# EasyEDA Pro project codeday-badge.eprj, board CodeDay Badge
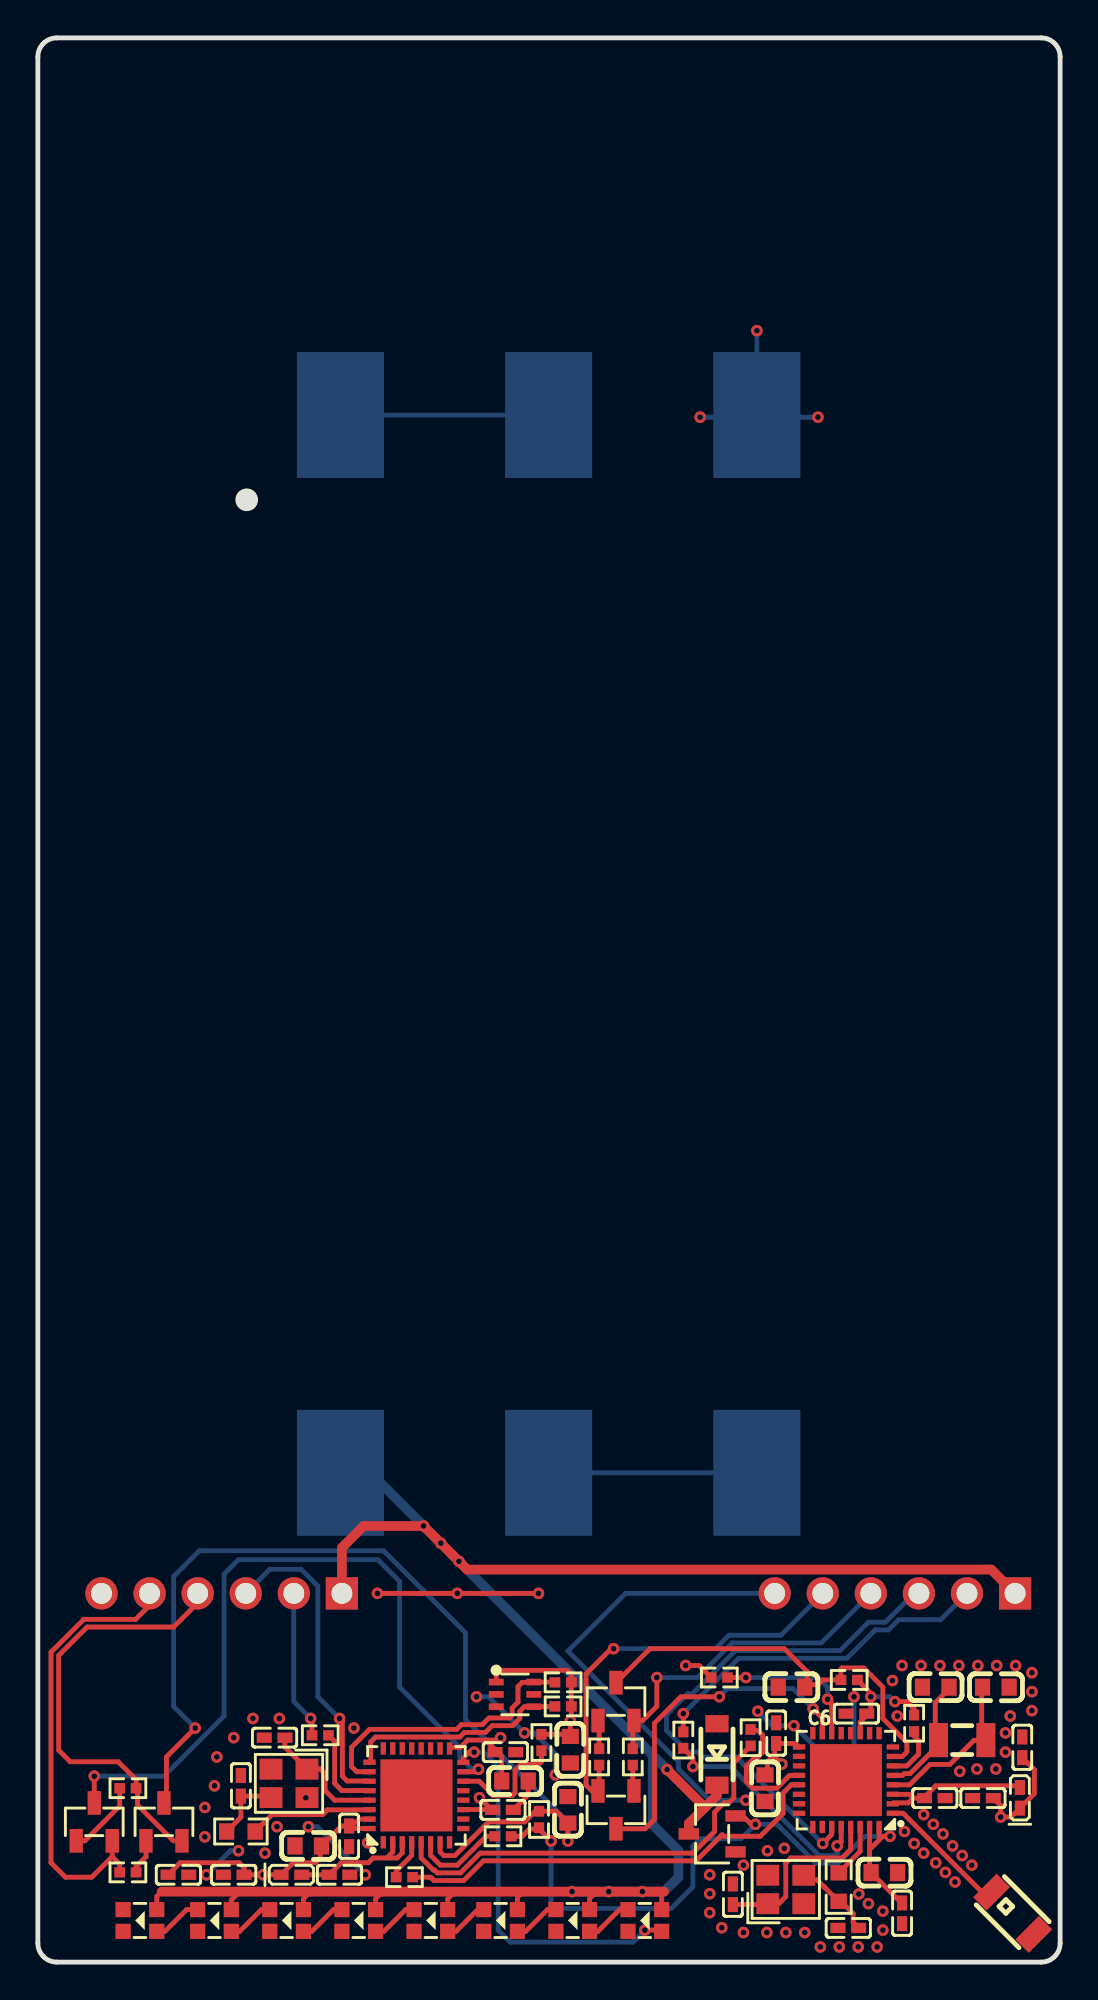
[diagram p4: board, top side]
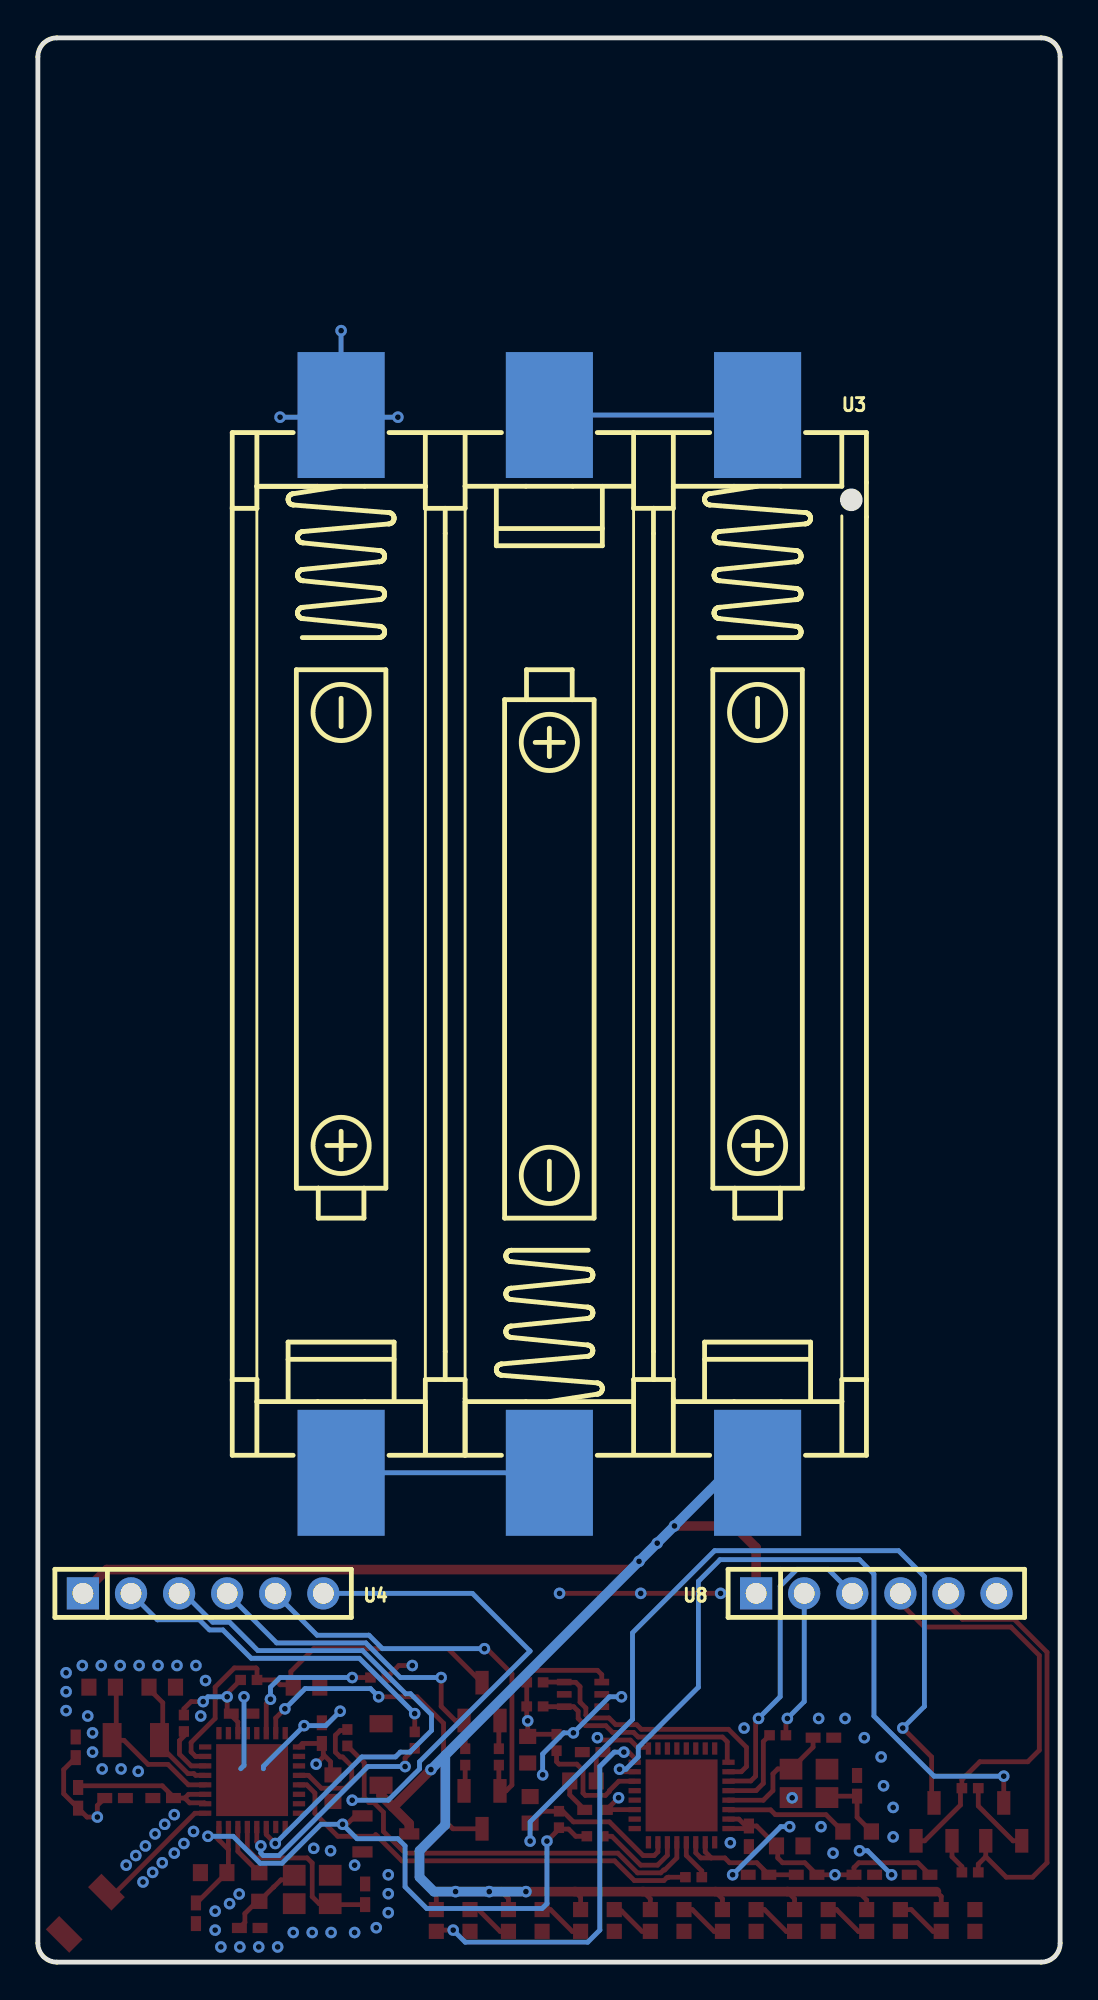
[diagram p5: board, bottom side, seen from below]

Outline 54 x 101.6 mm; copper layers: Top Layer, Bottom Layer. Coordinates in mm from the lower left corner of the outline.
Outline path: 0,100.6 0,1 arc(0.29,0.29) 1,0 53,0 arc(53.71,0.29) 54,1 54,100.6 arc(53.71,101.31) 53,101.6 1,101.6 arc(0.29,101.31) 0,100.6
Stack: Top Layer 0.035mm / Dielectric1 1.51mm FR4 er 4.5 / Bottom Layer 0.035mm

## Design rules (mm)
spacing safeClearance (default): track to track 0.152, other pairs 0.152 to 0.3
track width trackWidth (default): min 0.127, default 0.254, max 2.54
differential pair differentialPair (default): width min 0.127, default 0.254, max 2.54; gap min 0.152, default 0.152
via viaSize (default): diameter min 0.5, default 0.61, max 10; hole min 0.3, default 0.305, max 6

## Placement (name value [footprint] x y rotation side)
C1  10nF  [C0402]  45.65 2.58 90 top
C2  100nF  [C0402_NEW]  49.92 8.66 0 top
C3  1uF  [C0603]  44.72 4.72 180 top
C4  100nF  [C0402_NEW]  47.38 8.66 180 top
C5  10uF  [C0402]  52 11.34 270 top
C6  100nF  [C0402_NEW]  43.24 13.12 0 top
C7  100nF  [C0402_NEW]  39 12.09 270 top
C8  1uF  [C0603]  38.41 9.18 90 top
C9  10pF  [C0402]  36.71 3.58 90 top
C10  10pF  [C0402]  42.81 1.8 0 top
C11  15pF  [C0603]  50.6 14.52 180 top
C12  15pF  [C0603]  47.43 14.52 0 top
C13  1uF  [C0603]  39.81 14.52 0 top
C14  10nF  [C0402]  16.44 6.64 90 top
C15  100nF  [C0402_NEW]  7.42 4.61 180 top
C16  1uF  [C0603]  14.28 6.14 0 top
C17  100nF  [C0402_NEW]  15.93 4.61 180 top
C18  10uF  [C0402]  10.35 4.61 0 top
C19  100nF  [C0402_NEW]  24.57 8.04 180 top
C20  100nF  [C0402_NEW]  24.7 11.09 180 top
C21  1uF  [C0603]  25.2 9.56 180 top
C22  10pF  [C0402]  12.5 11.85 180 top
C23  10pF  [C0402]  10.73 9.31 270 top
C24  1uF  [C0603]  28 8.04 270 top
C25  1uF  [C0603]  28.13 11.22 90 top
D1  XL-0807RGBC-WS2812B  [LED-SMD_4P-L2.0-W1.8_CY-0807]  32.06 2.2 0 top
D2  XL-0807RGBC-WS2812B  [LED-SMD_4P-L2.0-W1.8_CY-0807]  28.25 2.2 0 top
D3  XL-0807RGBC-WS2812B  [LED-SMD_4P-L2.0-W1.8_CY-0807]  24.44 2.2 0 top
D4  XL-0807RGBC-WS2812B  [LED-SMD_4P-L2.0-W1.8_CY-0807]  20.76 2.2 0 top
D5  XL-0807RGBC-WS2812B  [LED-SMD_4P-L2.0-W1.8_CY-0807]  16.95 2.2 0 top
D6  XL-0807RGBC-WS2812B  [LED-SMD_4P-L2.0-W1.8_CY-0807]  13.14 2.2 0 top
D7  XL-0807RGBC-WS2812B  [LED-SMD_4P-L2.0-W1.8_CY-0807]  9.33 2.2 0 top
D8  XL-0807RGBC-WS2812B  [LED-SMD_4P-L2.0-W1.8_CY-0807]  5.39 2.2 0 top
D10  BZT52C5V1  [SOD-123_L2.7-W1.6-LS3.7-R-RD]  35.87 10.96 90 top
L1  2nH  [L0402-RD]  51.87 8.68 90 top
L2  2nH  [L0402-RD]  13.39 4.61 0 top
Q1  MMBT2222A 1P  [SOT-23-3_L2.9-W1.3-P1.90-LS2.4-BR]  30.54 8.04 90 top
Q2  MMBT2222A 1P  [SOT-23-3_L2.9-W1.3-P1.90-LS2.4-BR]  30.54 13.76 270 top
Q3  MMBT2222A 1P  [SOT-23-3_L2.9-W1.3-P1.90-LS2.4-BR]  2.98 7.41 270 top
Q4  MMBT2222A 1P  [SOT-23-3_L2.9-W1.3-P1.90-LS2.4-BR]  6.66 7.41 270 top
R1  10kΩ  [R0402]  46.29 12.61 270 top
R2  22Ω  [R0603]  42.3 3.96 270 top
R3  499Ω  [R0402]  34.09 11.72 90 top
R4  10kΩ  [R0402]  42.86 14.9 180 top
R5  12kΩ  [R0402]  31.43 10.83 270 top
R6  12kΩ  [R0402]  29.65 10.83 90 top
R7  10kΩ  [R0402]  36 15.03 0 top
R8  10kΩ  [R0402]  24.57 6.64 180 top
R9  22Ω  [R0603]  10.73 6.9 180 top
R10  499Ω  [R0402]  14.92 11.98 180 top
R11  10kΩ  [R0402]  26.6 11.6 270 top
R12  12kΩ  [R0402]  4.76 9.18 180 top
R13  12kΩ  [R0402]  4.76 4.74 0 top
R14  10kΩ  [R0402]  26.47 7.53 90 top
R15  499Ω  [R0402]  37.65 11.85 90 top
R16  499Ω  [R0402]  19.36 4.48 180 top
R17  2kΩ  [R0402]  27.74 14.77 0 top
R18  2kΩ  [R0402]  27.74 13.5 0 top
U1  ESP32-C3FH4  [QFN-32_L5.0-W5.0-P0.50-TL-EP3.7]  42.69 9.61 180 top
U2  XC6206P332MR  [SOT-23-3_L2.9-W1.6-P1.90-LS2.8-BR]  35.62 6.77 0 top
U3  BH-AAA-B5AA005  [BAT-SMD_BH-AAA-B5AA005]  26.98 53.76 270 bottom
U4  ad8fa1fdb8d44eac8dc13500dd650be4  [HDR-TH_6P-P2.54-V-M-A]  45.27 19.47 180 bottom
U5  ANT3216LL00R2400A  [ANT-SMD_L3.2-W1.6]  51.49 2.58 315 top
U6  ESP32-C3FH4  [QFN-32_L5.0-W5.0-P0.50-TL-EP3.7]  20 8.8 90 top
U7  LTR-303ALS-01  [SOT-363_L2.0-W1.3-P0.65-LS2.1-BL]  25.2 14.14 270 top
U8  ad8fa1fdb8d44eac8dc13500dd650be4  [HDR-TH_6P-P2.54-V-M-A]  9.71 19.47 180 bottom
X1  40MHz  [CRYSTAL-SMD_4P-L2.5-W2.0-BL]  39.51 3.84 0 top
X2  32.768kHz  [FC-135R_L3.2-W1.5]  48.83 11.72 0 top
X3  40MHz  [CRYSTAL-SMD_4P-L2.5-W2.0-BL]  13.27 9.44 180 top

## Footprints (pads in the part's own frame, mm; a bottom-side part is the same pattern mirrored in y, then rotated)
ANT-SMD_L3.2-W1.6
  rect 1x1.75 smd: 1(-1.578,0) 2(1.578,0)
BAT-SMD_BH-AAA-B5AA005
  rect 6.65x4.6 smd: 1(-27.925,11) 2(-27.925,0) 3(-27.925,-11) 4(27.925,-11) 5(27.925,0) 6(27.925,11)
C0402
  rect 0.79x0.54 smd: 1(-0.545,0) 2(0.545,0)
C0402_NEW
  rect 0.79x0.54 smd: 1(-0.545,0) 2(0.545,0)
C0603
  rect 0.8x0.9 smd: 1(-0.7,0) 2(0.7,0)
CRYSTAL-SMD_4P-L2.5-W2.0-BL
  rect 1.2x1.1 smd: 1(-0.95,-0.75) 2(0.95,-0.75) 3(0.95,0.75) 4(-0.95,0.75)
FC-135R_L3.2-W1.5
  rect 1x1.8 smd: 1(-1.25,0) 2(1.25,0)
HDR-TH_6P-P2.54-V-M-A
  rect 1.7x1.7 hole 1.1: 1(-6.35,0)
  round 1.7 hole 1.1: 2(-3.81,0) 3(-1.27,0) 4(1.27,0) 5(3.81,0) 6(6.35,0)
L0402-RD
  rect 0.79x0.54 smd: 1(-0.545,0) 2(0.545,0)
LED-SMD_4P-L2.0-W1.8_CY-0807
  rect 0.8x0.8 smd: 1(0.889,0.575) 2(-0.889,0.575) 3(-0.889,-0.575) 4(0.889,-0.575)
QFN-32_L5.0-W5.0-P0.50-TL-EP3.7
  rect 0.65x0.28 smd: 1(-2.478,1.75) 2(-2.478,1.25) 3(-2.478,0.75) 4(-2.478,0.25) 5(-2.478,-0.25) 6(-2.478,-0.75) 7(-2.478,-1.25) 8(-2.478,-1.75) 17(2.478,-1.75) 18(2.478,-1.25) 19(2.478,-0.75) 20(2.478,-0.25) 21(2.478,0.25) 22(2.478,0.75) 23(2.478,1.25) 24(2.478,1.75)
  rect 0.28x0.65 smd: 9(-1.75,-2.478) 10(-1.25,-2.478) 11(-0.75,-2.478) 12(-0.25,-2.478) 13(0.25,-2.478) 14(0.75,-2.478) 15(1.25,-2.478) 16(1.75,-2.478) 25(1.75,2.478) 26(1.25,2.478) 27(0.75,2.478) 28(0.25,2.478) 29(-0.25,2.478) 30(-0.75,2.478) 31(-1.25,2.478) 32(-1.75,2.478)
  rect 3.8x3.8 smd: 33(0,0)
R0402
  rect 0.566x0.54 smd: 1(-0.433,0) 2(0.433,0)
R0603
  rect 0.806x0.864 smd: 1(-0.753,0) 2(0.753,0)
SOD-123_L2.7-W1.6-LS3.7-R-RD
  rect 0.909x1.219 smd: 1(1.625,0) 2(-1.625,0)
SOT-23-3_L2.9-W1.3-P1.90-LS2.4-BR
  rect 1.25x0.7 smd: 1(1,-0.95) 2(1,0.95) 3(-1,0)
SOT-23-3_L2.9-W1.6-P1.90-LS2.8-BR
  rect 1.07x0.6 smd: 1(1.235,-0.95) 2(1.235,0.95) 3(-1.235,0)
SOT-363_L2.0-W1.3-P0.65-LS2.1-BL
  rect 0.35x0.78 smd: 1(-0.65,-0.99) 2(0,-0.99) 3(0.65,-0.99) 4(0.65,0.99) 5(0,0.99) 6(-0.65,0.99)

## Nets
As in the schematic.

Pads without a net: D8 2; U1 8 9 10 12 13 18 19 22 23 24 25 26; U5 2; U6 1 8 9 10 12 13 18 19 20 21 22 23 24; U7 2 5

## Via types
v1: diameter 0.61, hole 0.305, Top Layer to Bottom Layer, 115 vias

## Routing (per net, layer and track width the routed paths; a pad name or vN(x,y) marks a point on that pad's centre or on a via; arc(x,y) is an arc through that point)
+5V: length 117.4
  Top Layer w0.254: D7.1 10.22,3.28 10.66,3.72 ; D3.1 25.33,3.42 25.63,3.72 ; D1.1 32.95,3.6 33.08,3.72 ; 6.54,3.72 6.28,3.47 6.28,2.77 ; D4.1 21.65,3.34 22.03,3.72 ; 14.41,3.72 14.03,3.34 D6.1 ; 18.22,3.72 17.84,3.34 D5.1 ; 29.51,3.72 29.14,3.35 D2.1
  Top Layer w0.508: v1(33.24,10.17) 35.21,8.19 35.26,8.19 ; D10.2 35.87,8.8 35.26,8.19 ; U2.3 34.38,7.31 35.26,8.19 ; U8.1 16.06,21.88 17.2,23.03 20.37,23.03 v1(20.37,23.03) v1(21.28,22.12) v1(22.24,21.16) 22.68,20.73 50.36,20.73 U4.1 ; 33.08,3.72 v1(31.94,3.72) v1(30.16,3.72) v1(28.22,3.72) 6.54,3.72
  Bottom Layer w0.254: 15.98,25.33 18.08,25.33
  Bottom Layer w0.508: 28.51,3.72 v1(30.16,3.72) v1(31.94,3.72) 33.08,3.72 33.84,4.48 33.84,5.88 32.48,7.25 32.48,10.93 ; 32.48,10.93 v1(33.24,10.17) ; 32.48,10.93 v1(22.24,21.16) v1(21.28,22.12) v1(20.37,23.03) 18.08,25.33
GND: length 60.6
  Top Layer w0.254: X3.4 14.17,8.69 v1(14.16,8.68) ; C19.1 25.9,8.83 C21.1
  Bottom Layer w0.254: v1(41.21,81.57) 38.38,81.57 37.98,81.18 ; v1(23.17,14.01) 23.81,14.01 v1(25.71,12.1) 26.22,12.1 27.33,10.99 v1(27.33,9.89) ; U4.6 31.05,19.47 28,16.42 33.84,10.58 33.84,10.2 35.49,8.55 v1(37.4,8.55) ; 42.09,10.21 42.09,10.34 v1(39.94,12.49) 38.79,12.49 v1(38.03,13.25) ; v1(17.3,4.61) 14.76,7.15 v1(14.29,7.15) ; 43.29,10.21 43.11,10.38 v1(43.11,14.01) ; v1(8.9,4.61) 10.17,5.88 v1(10.6,5.88) ; v1(34.98,81.57) 37.59,81.57 37.98,81.18 ; 37.98,81.18 v1(37.98,86.14)
  vias: v1(8.82,8.17) v1(8.82,6.61) v1(9.33,9.31) v1(9.46,10.83) v1(10.35,11.85) v1(11.36,12.87) v1(12,5.75) v1(12.63,7.15) v1(12.76,12.87) v1(16.7,12.36) v1(17.42,6.3) v1(35.49,4.61) v1(35.49,3.61) v1(35.49,2.61) v1(36.13,1.82) v1(37.27,5.12) v1(37.27,1.56) v1(38.51,1.56) v1(38.54,5.88) v1(39.43,6.01) v1(39.51,1.56) v1(40.51,1.56) v1(41.33,0.8) v1(42.33,0.8) v1(43.36,3.6) v1(43.33,0.8) v1(43.87,3.09) v1(44.33,0.8) v1(44.64,2.69) v1(44.64,1.69) v1(45.14,14.87) v1(45.4,12.99) v1(45.65,15.66) v1(45.78,6.9) v1(46.29,6.26) v1(46.65,15.66) v1(46.79,7.79) v1(46.79,5.75) v1(47.3,7.28) v1(47.43,5.25) v1(47.65,15.66) v1(47.81,6.77) v1(47.94,4.74) v1(48.32,6.14) v1(48.45,4.23) v1(48.65,15.66) v1(48.7,10.07) v1(48.83,5.63) v1(49.33,5.12) v1(49.6,10.2) v1(49.65,15.66) v1(50.6,10.2) v1(50.65,15.66) v1(51.11,12.1) v1(51.11,11.09) v1(51.37,12.99) v1(51.65,15.66) v1(52.51,15.28) v1(52.51,14.28) v1(52.51,13.28)
VCC: length 93.3
  Top Layer w0.254: C19.2 23.97,8.04 23.95,8.05 ; v1(45.27,13.76) 45.91,13.76 46.29,13.37 R1.1 ; R8.1 25.58,6.64 25.97,7.02 26.4,7.02 R14.1 26.47,7.02 v1(27.11,6.39) ; 44.44,6.44 44.63,6.64 v1(45.02,6.64) ; 44.44,6.44 43.94,5.94 ; 44.44,6.44 U1.32 ; v1(37.9,7.28) 37.68,7.28 37.23,7.72 ; R4.1 44,14.19 v1(44,14.01) 44,13.24 43.44,12.68 U1.11 ; 43.94,5.94 U1.31 ; 43.94,5.94 43.94,4.8 C3.2 45.61,3.12 C1.2 ; C15.2 7.51,5.25 10.64,5.25 10.89,4.99 C18.2 v1(11.89,4.61) L2.1 13.48,5.25 14.66,5.25 14.92,5.5 14.92,6.07 C16.2 16.04,7.19 C14.2 ; C2.2 50.86,8.27 v1(50.86,7.66) 51.4,7.66 L1.1 52.64,8.89 52.64,10.16 52,10.8 ; 38.92,10.96 38.92,11.47 C7.2 40.02,11.55 U1.17 ; 38.92,10.96 38.54,10.58 38.54,9.88 ; 38.92,10.96 38.92,10.83 v1(39.3,10.45) ; C21.2 24.5,10.86 23.64,11.72 ; R11.1 28.01,12.03 C25.2 v1(28.13,12.74) 28.18,12.79 R18.2 R17.2 28.18,15.22 27.99,15.41 24.44,15.41 24.21,15.18 U7.1 ; v1(34.22,15.66) 34.93,15.66 R7.1 ; U6.31 16.97,7.55 16.61,7.19 C14.2 ; C14.2 16.58,7.05 U6.32 ; U6.11 23.95,8.05 ; 23.95,8.05 v1(23.33,8.68) ; U6.17 21.81,11.34 22.32,11.34 22.7,11.72 23.64,11.72 ; 23.64,11.72 24.32,11.72 v1(24.44,11.85) ; v1(26.44,19.47) v1(22.16,19.47) v1(17.94,19.47)
  Bottom Layer w0.254: v1(45.27,13.76) 45.02,14.01 v1(44,14.01) ; v1(27.11,6.39) 27.11,3.09 27.36,2.83 33.46,2.83 34.6,3.98 34.6,6.14 34.98,6.52 37.14,6.52 v1(37.9,7.28) 39.04,7.28 41.1,5.22 42.26,5.22 43.69,6.64 v1(45.02,6.64)
DTR: length 22.3
  Top Layer w0.254: R6.1 29.65,9.1 Q1.2 29.27,9.04 28.96,9.35 28.96,15.22 30.28,16.55 v1(30.41,16.55)
  Bottom Layer w0.254: v1(30.41,16.55) 35.8,16.55 36.51,17.26 39.25,17.26 U4.5
DTR_LED: length 23.8
  Top Layer w0.254: Q3.2 3.93,5.57 ; 3.93,5.57 4.32,5.17 R13.1 ; 3.93,5.57 2.85,4.48 1.46,4.48 0.69,5.25 0.69,16.36 2.43,18.1 5.16,18.1 5.9,18.84 U8.5
EN: length 22.1
  Top Layer w0.254: 40.64,14.64 41.21,14.64 41.46,14.9 R4.2 42.42,15.48 42.48,15.53 43.62,15.53 44.64,14.52 44.64,12.87 45.91,11.6 45.91,11.1 45.67,10.86 U1.7 ; 40.64,14.64 40.64,15.34 39.43,16.55 32.33,16.55 Q2.3 ; 40.64,14.64 C13.2
EN_LED: length 53.6
  Top Layer w0.254: Q4.3 6.79,8.53 6.79,10.83 v1(8.31,12.36) ; U6.7 21.25,5.82 21.44,5.63 22.03,5.63 23.81,7.41 25.71,7.41 26.27,7.97 R14.2 27.37,7.97 C24.2 v1(28,6.39)
  Bottom Layer w0.254: v1(28,6.39) 28,7.41 22.59,12.82 22.59,17.39 18.25,21.72 8.53,21.72 7.17,20.36 7.17,13.5 v1(8.31,12.36)
LED: length 20.3
  Top Layer w0.254: v1(23.05,11.09) 22.79,11.09 22.47,10.77 U6.16 ; v1(32.06,1.69) 32.88,1.69 D1.4
  Bottom Layer w0.254: v1(23.05,11.09) 23.55,11.09 24.32,10.33 24.32,1.69 24.95,1.06 31.43,1.06 v1(32.06,1.69)
RTS: length 17.7
  Top Layer w0.254: R5.1 31.43,12.69 Q2.2 31.95,12.76 32.7,13.5 v1(32.7,15.03)
  Bottom Layer w0.254: v1(32.7,15.03) 34.85,15.03 36.68,16.85 41.38,16.85 U4.4
RTS_LED: length 23.2
  Top Layer w0.254: U8.4 8.44,18.96 7.17,17.69 2.6,17.69 1.1,16.19 1.1,11.19 1.71,10.58 4.24,10.58 5.19,9.63 R12.1 5.27,9.11 5.27,8.29 7.15,6.41 Q4.2
RX: length 28.6
  Top Layer w0.254: U1.27 41.94,6.74 v1(41.46,6.26)
  Bottom Layer w0.254: U4.3 46.29,19.47 44.76,17.95 43.87,17.95 42.37,16.45 36.85,16.45 34.57,14.17 34.31,14.17 33.2,13.06 33.2,12.23 34.35,11.09 34.86,11.09 35.11,10.83 36.89,10.83 v1(41.46,6.26)
RX_LED: length 16.7
  Top Layer w0.254: 17.4,9.56 16.34,9.56 16.09,9.82 16.09,12.71 v1(15.93,12.87)
  Bottom Layer w0.254: U8.3 12.25,20.74 13.9,20.74 14.79,19.85 14.79,14.01 v1(15.93,12.87)
SCL_LED: length 11.8
  Top Layer w0.254: R18.1 27.3,13.49 U7.4 25.7,13.49 25.46,13.25 25.46,12.87 25.08,12.49 24,12.49 23.64,12.13 22.54,12.13 22.29,11.88 17.84,11.88 17.58,11.63 17.58,10.62 U6.25
SDA_LED: length 15
  Top Layer w0.254: R17.1 27.3,14.79 U7.6 26.18,14.77 25.58,14.77 25.36,14.55 25.36,13.73 25.05,13.42 25.05,13.03 24.91,12.89 23.83,12.89 23.47,12.54 22.37,12.54 22.12,12.29 17.52,12.29 16.57,11.34 16.57,10.33 16.84,10.05 U6.26
STRAP: length 18.4
  Top Layer w0.254: v1(36,14.01) 33.97,14.01 32.57,12.61 32.57,7.53 32.08,7.04 Q1.3 ; U1.15 41.44,12.89 v1(40.95,13.37)
  Bottom Layer w0.254: v1(36,14.01) 36.43,14.44 39.89,14.44 v1(40.95,13.37)
STRAP_LED: length 39.8
  Top Layer w0.254: v1(23.27,10.18) 23.14,10.05 U6.15 ; v1(2.98,9.82) Q3.3
  Bottom Layer w0.254: v1(2.98,9.82) 6.66,9.82 9.84,12.99 9.84,20.49 10.6,21.25 17.97,21.25 19.11,20.11 19.11,14.52 22.28,11.34 22.28,10.83 22.93,10.18 v1(23.27,10.18)
TX: length 18.6
  Top Layer w0.254: v1(34.09,13.12) R3.2
  Bottom Layer w0.254: U4.2 47.68,18.07 45.46,18.07 44.93,17.54 44.23,17.54 42.73,16.04 37.02,16.04 v1(34.09,13.12)
TX_LED: length 7.9
  Top Layer w0.254: v1(14.41,12.87) 14.48,12.79 R10.2
  Bottom Layer w0.254: v1(14.41,12.87) 13.52,13.76 U8.2
X_RX: length 23
  Top Layer w0.254: U6.5 20.25,5.5 20.89,4.87 20.95,4.87 21.1,4.71 22.32,4.71 23.37,5.75 34.6,5.75 35.75,6.9 35.75,7.91 36.25,8.42 36.51,8.42 36.76,8.68 36.76,10.53 R15.1
X_TX: length 23.5
  Top Layer w0.254: 36.07,6.64 36.06,6.64 36.15,6.73 36.07,6.64 ; 36.07,6.64 38.16,6.64 39.37,7.85 39.37,8.93 39.8,9.36 U1.21 ; 36.07,6.64 34.77,5.35 23.53,5.35 22.49,4.31 20.93,4.31 20.78,4.46 20.72,4.46 20.69,4.48 R16.1
$4N1420: length 8.3
  Top Layer w0.254: 46.24,8.66 46.04,8.86 U1.3 ; 46.24,8.66 46.84,8.66 46.84,8.72 47.43,9.31 51.78,9.31 L1.2 ; 46.24,8.66 45.98,8.41 45.21,8.41 U1.2
$4N2104: length 2.8
  Top Layer w0.254: 46.16,12.05 46.52,11.69 46.52,10.98 45.9,10.36 U1.6
$4N4744: length 9.6
  Top Layer w0.254: C9.1 38.51,3.04 X1.1 39.14,3.09 39.51,3.45 39.51,5.23 39.78,5.5 42.48,5.5 42.94,5.96 U1.29
$4N6093: length 4.3
  Top Layer w0.254: X1.3 40.7,4.34 41.16,4.34 41.54,3.96 41.55,3.96 R2.2 42.42,3.21 43.06,2.57 43.06,2.09 C10.2
$4N6163: length 2.9
  Top Layer w0.254: U1.30 43.44,5.85 R2.1
$4N9588: length 8.4
  Top Layer w0.254: U1.4 46.05,9.36 47.13,10.44 48.18,10.44 49.45,11.71 49.9,11.71 49.86,11.75 49.86,14.38
$4N9606: length 6.2
  Top Layer w0.254: U1.5 45.67,9.86 45.76,9.95 46.07,9.95 47.4,11.29 47.4,13.7 48.08,14.38
$4N10792: length 12.3
  Top Layer w0.254: v1(42.22,6.14) 42.44,6.35 U1.28 ; v1(34.6,10.33) 34.6,10.78 R3.1
  Bottom Layer w0.254: v1(42.22,6.14) 42.22,5.75 42.1,5.63 41.27,5.63 36.57,10.33 v1(34.6,10.33)
$4N18905: length 8
  Top Layer w0.254: v1(37.4,15.03) R7.2 ; v1(41.71,13.88) 41.94,13.66 U1.14
  Bottom Layer w0.254: v1(41.71,13.88) 41.71,14.52 41.21,15.03 v1(37.4,15.03)
$4N19208: length 6.9
  Top Layer w0.254: U1.1 45.7,7.86 49.87,3.7 50.38,3.7
$4N36490: length 6.8
  Top Layer w0.254: 37.65,12.28 37.7,12.23 38.03,12.23 38.29,11.98 38.29,11.09 38.03,10.83 37.9,10.83 37.42,10.35 37.42,9.54 37.78,9.18 39.03,9.18 39.7,9.86 U1.20
$7N1471: length 3.8
  Top Layer w0.254: X3.3 12.24,8.77 C23.2 10.73,7.65 R9.2
$7N1472: length 6.7
  Top Layer w0.254: C22.1 13.05,11.35 X3.1 14.23,10.2 14.92,10.2 15.17,9.95 15.17,9.06 15.68,8.55 17.52,8.55 U6.29
$7N1473: length 6.5
  Top Layer w0.254: R9.1 12.37,7.79 15.04,7.79 15.3,8.04 17.51,8.04 U6.30
$7N1477: length 7.3
  Top Layer w0.254: U6.2 18.75,5.82 18.43,5.5 ; U6.3 19.25,5.77 18.98,5.5 18.43,5.5 ; 18.43,5.5 17.71,5.5 17.46,5.25 16.02,5.25 C17.2 L2.2
$7N1480: length 4.7
  Top Layer w0.254: R10.1 15.68,11.65 15.68,9.44 16.06,9.06 17.52,9.06 U6.28
$7N1488: length 4.9
  Top Layer w0.254: R8.2 23.68,6.64 22.16,5.12 21.27,5.12 20.75,5.64 U6.6
$7N1489: length 6.5
  Top Layer w0.254: U6.14 23.31,9.55 23.81,9.06 23.81,9.02 24.02,8.8 25.08,8.8 25.2,8.93 25.2,10.12 25.53,10.45 26.47,10.45 26.6,10.58 R11.2
$7N7409: length 2.5
  Top Layer w0.254: D2.4 29.58,1.62 30.73,2.77 D1.2
$7N7410: length 2.5
  Top Layer w0.254: D3.4 25.77,1.62 26.92,2.77 27.36,2.77
$7N7411: length 2.6
  Top Layer w0.254: 23.81,2.77 23.74,2.71 23.17,2.71 22.09,1.62 D4.4
$7N7412: length 2.6
  Top Layer w0.254: D5.4 18.28,1.62 19.43,2.77 20,2.77
$7N7413: length 2.5
  Top Layer w0.254: D6.4 14.47,1.62 15.62,2.77 D5.2
$7N7414: length 2.5
  Top Layer w0.254: D7.4 10.66,1.62 11.81,2.77 D6.2
$7N7767: length 2.6
  Top Layer w0.254: 6.28,1.62 6.71,1.62 7.86,2.77 D7.2
$7N7899: length 2.2
  Top Layer w0.254: R16.2 18.93,4.81 19.75,5.63 U6.4
$8N431: length 1.4
  Top Layer w0.254: Q1.1 31.43,9.1 R5.2
$8N432: length 1.5
  Top Layer w0.254: Q2.1 29.65,12.69 R6.2
$8N941: length 11
  Bottom Layer w0.254: U3.5 U3.4
$8N942: length 11
  Bottom Layer w0.254: U3.1 U3.2
$8N1473: length 4
  Top Layer w0.254: Q3.1 2.49,6.41 4.32,8.24 R12.2
$8N1474: length 1.9
  Top Layer w0.254: R13.2 5.19,5.04 5.71,5.57 Q4.1

## Copper pours and planes (outline as drawn; the poured copper is in the pictures)
GND on Top Layer: 0,101.6 54,101.6 54,0 0,0
GND on Bottom Layer: 40.11,12.19 45.19,12.19 45.19,7.11 40.11,7.11
GND on Bottom Layer: 41.76,3.4 47.08,8.72 50.48,5.33 45.15,0
GND on Bottom Layer: 45.02,8.68 47.05,8.68 47.05,6.64 45.02,6.64
GND on Bottom Layer: 10.73,13.52 12.86,13.52 14.03,12.36 16.09,12.36 16.98,13.25 22.28,13.25 22.28,6.27 22.33,6.23 15.07,6.23 14.92,6.07 13.33,6.07 12.5,5.25 9.08,5.25 8.19,6.14 8.19,10.88 10.73,13.42
GND on Bottom Layer: 34.8,6.2 45.02,6.2 45.02,0.29 34.8,0.29
GND on Bottom Layer: 44.64,16.04 52.76,16.04 52.76,9.95 44.64,9.95
VCC on Bottom Layer: 0,101.6 54,101.6 54,0 0,0
